# Altium schematic sheet CH340-Sch.SchDoc
size A
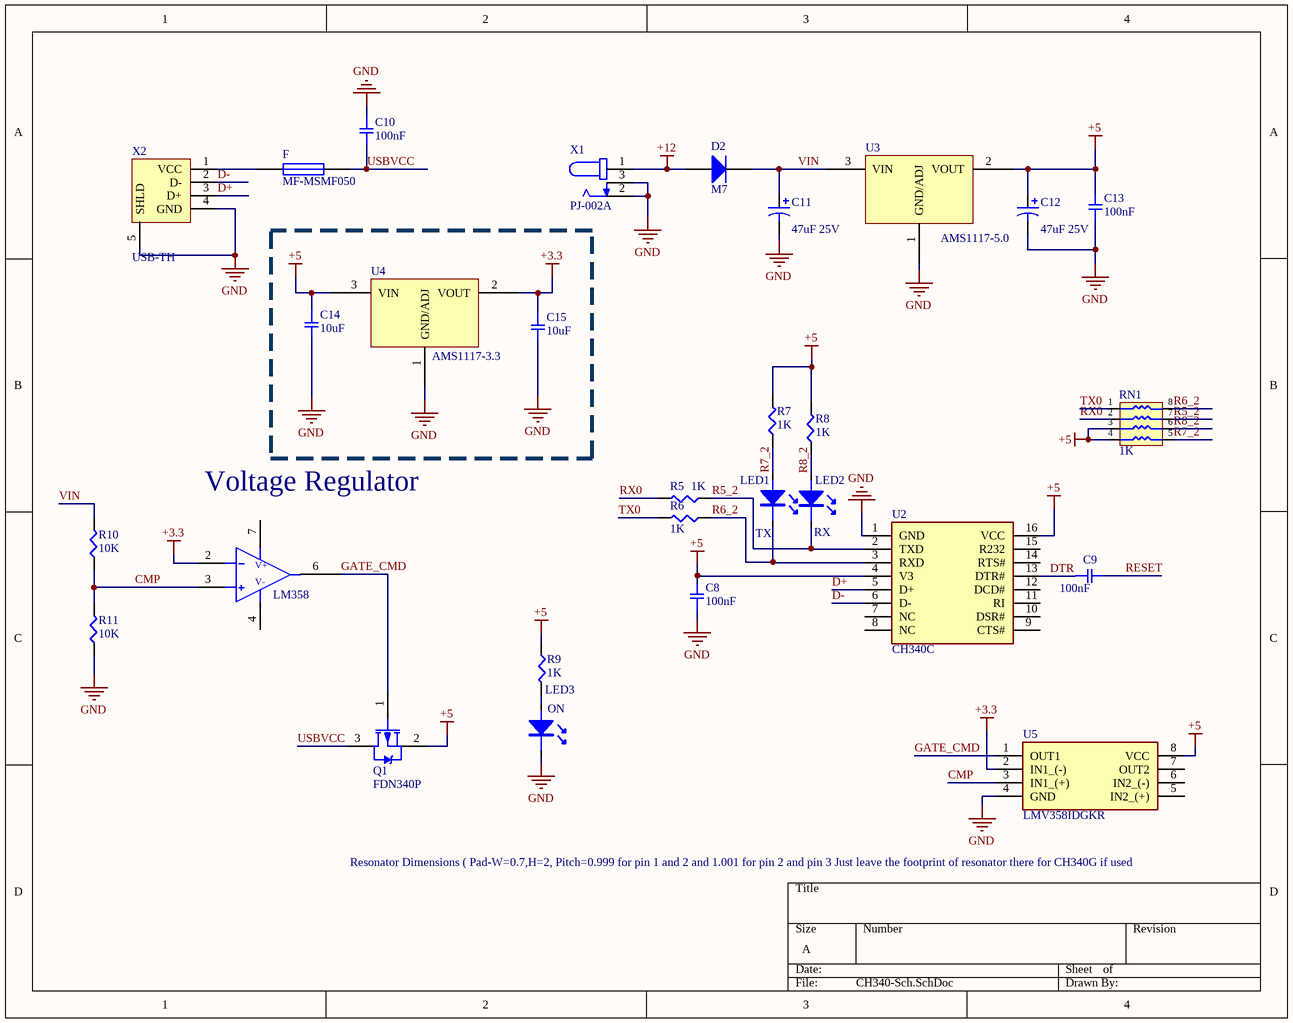
[diagram p0: CH340-Sch.SchDoc]

## Parts
C8  100nF  [SMD-0805C]
C9  100nF  [SMD-0805C]
C10  100nF  [SMD-0805C]
C11  value 47uF 25V  [Elec-Cap-SMD]  (hidden comment: 47uF SMD)
C12  value 47uF 25V  [Elec-Cap-SMD]  (hidden comment: 47uF SMD)
C13  100nF  [SMD-0805C]
C14  10uF  [SMD-0805C]
C15  10uF  [SMD-0805C]
D2  M7  [D0214AC(SMA-2)]
F  MF-MSMF050  [MF-MSMF050-2 (LCSC)]
LED1  TX  [Blue_LED_0805]
LED2  RX  [Blue_LED_0805]
LED3  ON  [RED_LED_0805]
Q1  FDN340P  [SOT-23-3]
R5  1K
R6  1K
R7  1K
R8  1K
R9  1K  [SMD-0805-RES]
R10  10K  [SMD-0805-RES]
R11  10K  [SMD-0805-RES]
RN1  1K  [RA0603-8]
U2  CH340C  [SOIC-16 150MIL(LCSC)]
U3  AMS1117-5.0  [SOT-223]
U4  AMS1117-3.3  [SOT-223]
U5  LMV358IDGKR  [VSSOP-8]
U6  LM358
X1  PJ-002A  [PJ-002A]
X2  USB-TH  [USB-TypeB Female (LCSC)]

## Nets
+3.3: C15.1 U4.2(VOUT) U5.2(IN1_(-)) U6.2(INV)
+5: C8.2 C12.1 C13.2 C14.1 Q1.2(S) R7.2 R8.2 R9.1 RN1.3 RN1.4 U2.4(V3) U2.16(VCC) U3.2(VOUT) U4.3(VIN) U5.8(VCC)
+12: D2.1(A) X1.1
GND: C8.1 C10.2 C11.2 C12.2 C13.1 C14.2 C15.2 LED3.2(K) R11.1 U2.1(GND) U3.1(GND/ADJ) U4.1(GND/ADJ) U5.4(GND) X1.2 X1.3 X2.4(GND) X2.5(SHLD)
CMP: R10.1 R11.2 U5.3(IN1_(+)) U6.3(NON-INV)
D+: U2.5(D+) X2.3(D+)
D-: U2.6(D-) X2.2(D-)
DTR: C9.1 U2.13(DTR#)
GATE_CMD: Q1.1(G) U5.1(OUT1) U6.6(O/P)
R5_2: LED2.2(K) R5.1 RN1.7 U2.2(TXD)
R6_2: LED1.2(K) R6.1 RN1.8 U2.3(RXD)
R7_2: LED1.1(A) R7.1 RN1.5
R8_2: LED2.1(A) R8.1 RN1.6
RESET: C9.2
RX0: R5.2 RN1.2
TX0: R6.2 RN1.1
USBVCC: C10.1 F.2 Q1.3(D)
VIN: C11.1 D2.2(K) R10.2 U3.3(VIN)
NetF_1: F.1 X2.1(VCC)
NetLED3_1: LED3.1(A) R9.2

Not connected (* = marked no-connect by the designer): U2 7(NC) 8(NC) 9(CTS#) 10(DSR#) 11(RI) 12(DCD#) 14(RTS#) 15(R232); U5 5(IN2_(+)) 6(IN2_(-)) 7(OUT2); U6 4(GND) 7(VCC)

## Notes on the sheet
- (near U6) Voltage Regulator
- Resonator Dimensions ( Pad-W=0.7,H=2, Pitch=0.999 for pin 1 and 2 and 1.001 for pin 2 and pin 3 Just leave the footprint of resonator there for CH340G if used
- (in symbol CA3140) V+; V-

## Library data of the parts
C8-C10 C13-C15 = GC321AD72E103KX01D: CAP CER 10000PF 250V X7T 0805; Manufacturer: Murata Electronics North America; Factory Stock: 0; Unit Price (USD): 0.3; Minimum Quantity: 1; Tolerance: ±10%; Datasheets: http://search.murata.co.jp/Ceramy/image/img/A01X/G101/ENG/GC321AD72E103KX01-01.pdf; Image: //media.digikey.com/Renders/Murata%20Renders/0805(GC3)200x125.jpg; Digi-Key Part Number: 490-13986-1-ND; Part Number: GC321AD72E103KX01D; Quantity Available: 4000; @ qty: 0; Packaging: Cut Tape (CT); Series: GC3; Part Status: Active; Value: 10000pF; Voltage: 250V; Temperature Coefficient: X7T; Operating Temperature: -55°C ~ 125°C; Features: -; Ratings: AEC-Q200; Applications: Automotive; Mounting Type: Surface Mount, MLCC; Package / Case: 0805 (2012 Metric); Size / Dimension: 0.079" L x 0.049" W (2.00mm x 1.25mm); Height - Seated (Max): -; Thickness (Max): 0.039" (1.00mm); Lead Spacing: -; Lead Style: -
C11 C12 = Cap Pol2: Polarized Capacitor (Axial); Published: 8-Jun-2000; LatestRevisionDate: 17-Jul-2002; LatestRevisionNote: Re-released for DXP Platform.; PackageReference: POLAR0.8; Publisher: Altium Limited; PackageDescription: Polarized Capacitor; 2 Leads
D2 = Diode: Default Diode; Published: 8-Jun-2000; LatestRevisionDate: 17-Jul-2002; LatestRevisionNote: Re-released for DXP Platform.; PackageVersion: Sep-1996; PackageReference: SMC; Publisher: Altium Limited; PackageDescription: DO-214-AB/SMC; 2 C-Bend Leads; Body 7.9 x 5.9 mm, inc. leads (LxW); Code_JEDEC: DO-214-AB
F = Fuse 1: Fuse; Published: 8-Jun-2000; LatestRevisionDate: 17-Jul-2002; LatestRevisionNote: Re-released for DXP Platform.; PackageReference: PIN-W2/E2.8; Publisher: Altium Limited; PackageDescription: Thru-Hole; 2 Leads
LED1-LED3 = LED 5V: SMT LED
Q1 = FDN340P: P-Channel  MOSFET SMD CODE=A1SHB; Note: Pin 2 is electrically connected to pin 4.; Published: 8-Jun-2000; LatestRevisionDate: 17-Jul-2002; LatestRevisionNote: Re-released for DXP Platform.; DatasheetVersion: PD-9.814; PackageVersion: Feb-1997; PackageReference: TO-220AB; Publisher: Altium Limited; PackageDescription: TO, Thru-Hole, Vertical, Heatsink Mounted; 3 In-Line Leads; Pitch 2.54 mm; ComponentLink1Description: Manufacturer Link; ComponentLink1URL: http://www.irf.com/
R5-R11 = ERJ-6BQF1R1V: RES SMD 1.1 OHM 1% 1/3W 0805; Manufacturer: Panasonic Electronic Components; Factory Stock: 0; Unit Price (USD): 0.05834; @ qty: 1500; Minimum Quantity: 1; Value: 1.1; Power (Watts): 0.333W, 1/3W; Temperature Coefficient: ±200ppm/°C; Part Number: ERJ-6BQF1R1V; Datasheets: https://industrial.panasonic.com/cdbs/www-data/pdf/RDA0000/AOA0000C239.pdf; Image: //media.digikey.com/Renders/Panasonic%20Renders/ERJ-0805%20Pkg.jpg; Digi-Key Part Number: P17500CT-ND; Quantity Available: 34000; Packaging: Cut Tape (CT); Series: ERJ; Part Status: Active; Tolerance: ±1%; Composition: Thick Film; Features: Automotive AEC-Q200, Current Sense; Operating Temperature: -55°C ~ 125°C; Package / Case: 0805 (2012 Metric); Supplier Device Package: 0805; Size / Dimension: 0.079" L x 0.049" W (2.00mm x 1.25mm); Height - Seated (Max): 0.028" (0.70mm); Number of Terminations: 2; Failure Rate: -
RN1 = RES_NETWORK: 330 Ohm Â±5% 62.5mW Power Per Element Isolated Resistor Network/Array Â±200ppm/Â°C 1206 _3216 Metric_, Convex, Long Side Terminals; MF: Yageo; MP: YC164-JR-07330RL; Price: None; Availability: Unavailable; SnapEDA_Link: https://www.snapeda.com/parts/YC164-JR-07330RL/Yageo/view-part/106017/?ref=snap; Value: *; Package: 1206 Yageo
U2 = CH340C: Integrated Circuit; Manufacturer_Name: Maxim Integrated; Manufacturer_Part_Number: DS3231SN#; Datasheet Link: https://datasheets.maximintegrated.com/en/ds/DS3231.pdf; Height: 2.65mm; Mouser Part Number: 700-DS3231SN#; Mouser Price/Stock: https://www.mouser.com/Search/Refine.aspx?Keyword=700-DS3231SN%23; RS Part Number: 1897251; RS Price/Stock: http://uk.rs-online.com/web/p/products/1897251
U3 U4 = AMS1117: AMS1117-3.3, Voltage Regulator
U5 = LM358N: Integrated Circuit; Manufacturer_Name: ON Semiconductor; Datasheet Link: http://www.onsemi.com/pub/Collateral/LM358A-D.pdf; Height: 5.33mm; Manufacturer_Part_Number: LM358N; Arrow Part Number: LM358N; Arrow Price/Stock: https://www.arrow.com/en/products/lm358n/on-semiconductor; Mouser Part Number: 512-LM358N; Mouser Price/Stock: https://www.mouser.co.uk/ProductDetail/ON-Semiconductor-Fairchild/LM358N?qs=K0aVCp%2F7QwafyMXZgr%2FPfw%3D%3D
U6 = CA3140: 4.5MHz BiMOS Op-Amp with Mosfet Input; Published: 8-Jun-2000; LatestRevisionDate: 17-Jul-2002; LatestRevisionNote: Re-released for DXP Platform.; DatasheetVersion: REV. B; PackageVersion: 1990; PackageReference: H-08A; Publisher: Altium Limited; PackageDescription: Can; 8 Leads; Pin Circle Dia. 5.08 mm; Lead Dia. 0.53 mm (max); ComponentLink1Description: Manufacturer Link; ComponentLink1URL: http://www.analog.com/
X1 = PJ-002A: 2,0 x 6,5 mm, 2,5 A, Yatay, AÃ§Ä±k Delik, Dc GÃ¼Ã§ JakÄ± KonnektÃ¶rÃ¼; MF: CUI Devices; Package: None; Price: None; CUI_purchase_URL: https://www.cuidevices.com/product/interconnect/connectors/dc-power-connectors/jacks/pj-002a?utm_source=snapeda.com&utm_medium=referral&utm_campaign=snapedaBOM; SnapEDA_Link: https://www.snapeda.com/parts/PJ-002A/CUI%20Devices/view-part/287588/?ref=snap; Availability: Unavailable; Value: *; MP: PJ-002A
X2 = USB-Type B: USB-Type B Female